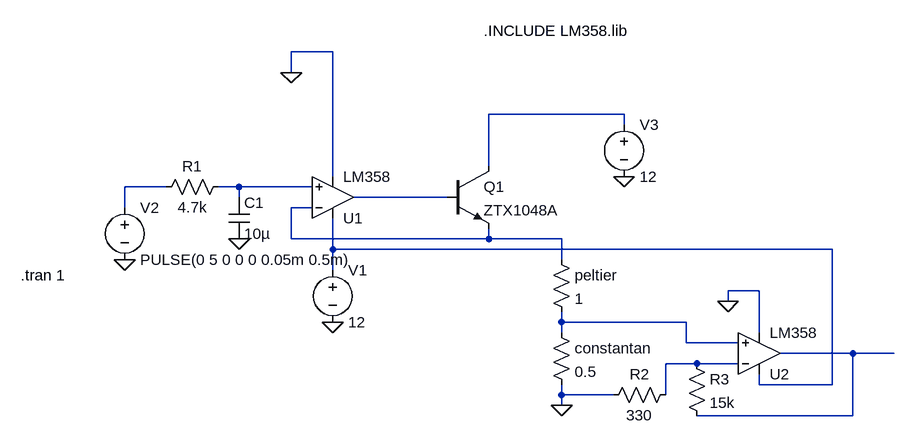
[diagram p0: schematic fuente_de_corriente.asc]
fuente_de_corriente.asc, the LTspice schematic file:
Version 4
SHEET 1 1100 680
WIRE 192 -32 128 -32
WIRE 128 0 128 -32
WIRE 640 64 432 64
WIRE 640 80 640 64
WIRE 432 144 432 64
WIRE 192 160 192 -32
WIRE -64 176 -128 176
WIRE 48 176 16 176
WIRE 160 176 48 176
WIRE 48 192 48 176
WIRE 368 192 224 192
WIRE -128 208 -128 176
WIRE 160 208 128 208
WIRE 128 256 128 208
WIRE 432 256 432 240
WIRE 432 256 128 256
WIRE 544 256 432 256
WIRE 192 272 192 224
WIRE 960 272 192 272
WIRE 544 288 544 256
WIRE 192 304 192 272
WIRE 848 336 800 336
WIRE 800 352 800 336
WIRE 544 384 544 368
WIRE 736 384 544 384
WIRE 544 400 544 384
WIRE 848 400 848 336
WIRE 736 416 736 384
WIRE 816 416 736 416
WIRE 992 432 880 432
WIRE 1056 432 992 432
WIRE 752 448 704 448
WIRE 816 448 752 448
WIRE 848 480 848 464
WIRE 960 480 960 272
WIRE 960 480 848 480
WIRE 544 496 544 480
WIRE 624 496 544 496
WIRE 704 496 704 448
WIRE 544 512 544 496
WIRE 992 528 992 432
WIRE 992 528 752 528
FLAG -128 288 0
FLAG 192 384 0
FLAG 48 256 0
FLAG 640 160 0
FLAG 128 0 0
FLAG 544 512 0
FLAG 800 352 0
SYMBOL voltage -128 192 R0
WINDOW 123 0 0 Left 2
WINDOW 39 0 0 Left 2
SYMATTR InstName V2
SYMATTR Value PULSE(0 5 0 0 0 0.05m 0.5m)
SYMBOL voltage 192 288 R0
SYMATTR InstName V1
SYMATTR Value 12
SYMBOL npn 368 144 R0
SYMATTR InstName Q1
SYMATTR Value ZTX1048A
SYMBOL voltage 640 64 R0
SYMATTR InstName V3
SYMATTR Value 12
SYMBOL cap 32 192 R0
SYMATTR InstName C1
SYMATTR Value 10µ
SYMBOL res 32 160 R90
WINDOW 0 0 56 VBottom 2
WINDOW 3 32 56 VTop 2
SYMATTR InstName R1
SYMATTR Value 4.7k
SYMBOL res 528 272 R0
SYMATTR InstName peltier
SYMATTR Value 1
SYMBOL Opamps\\opamp2 192 256 M180
SYMATTR InstName U1
SYMATTR Value LM358
SYMBOL res 528 384 R0
SYMATTR InstName constantan
SYMATTR Value 0.5
SYMBOL Opamps\\opamp2 848 496 M180
SYMATTR InstName U2
SYMATTR Value LM358
SYMBOL res 736 432 R0
SYMATTR InstName R3
SYMATTR Value 15k
SYMBOL res 608 512 R270
WINDOW 0 32 56 VTop 2
WINDOW 3 0 56 VBottom 2
SYMATTR InstName R2
SYMATTR Value 330
TEXT -288 312 Left 2 !.tran 1
TEXT 424 -64 Left 2 !.INCLUDE LM358.lib

The netlist it stands for:
* fuente_de_corriente.asc
V2 N002 0 PULSE(0 5 0 0 0 0.05m 0.5m)
V1 N006 0 12
Q1 N001 N004 N005 0 ZTX1048A
V3 N001 0 12
C1 N003 0 10µ
R1 N003 N002 4.7k
R§peltier N005 N007 1
XU1 N003 N005 N006 0 N004 LM358  ; pins In+ In- V+ V- OUT
R§constantan N007 0 0.5
XU2 N007 N009 N006 0 N008 LM358  ; pins In+ In- V+ V- OUT
R3 N009 N008 15k
R2 0 N009 330
.model NPN NPN
.model PNP PNP
.lib standard.bjt
.tran 1
.INCLUDE LM358.lib
.backanno
.end